# EAGLE design Prog_NRF52 (EAGLE 7.5.0)
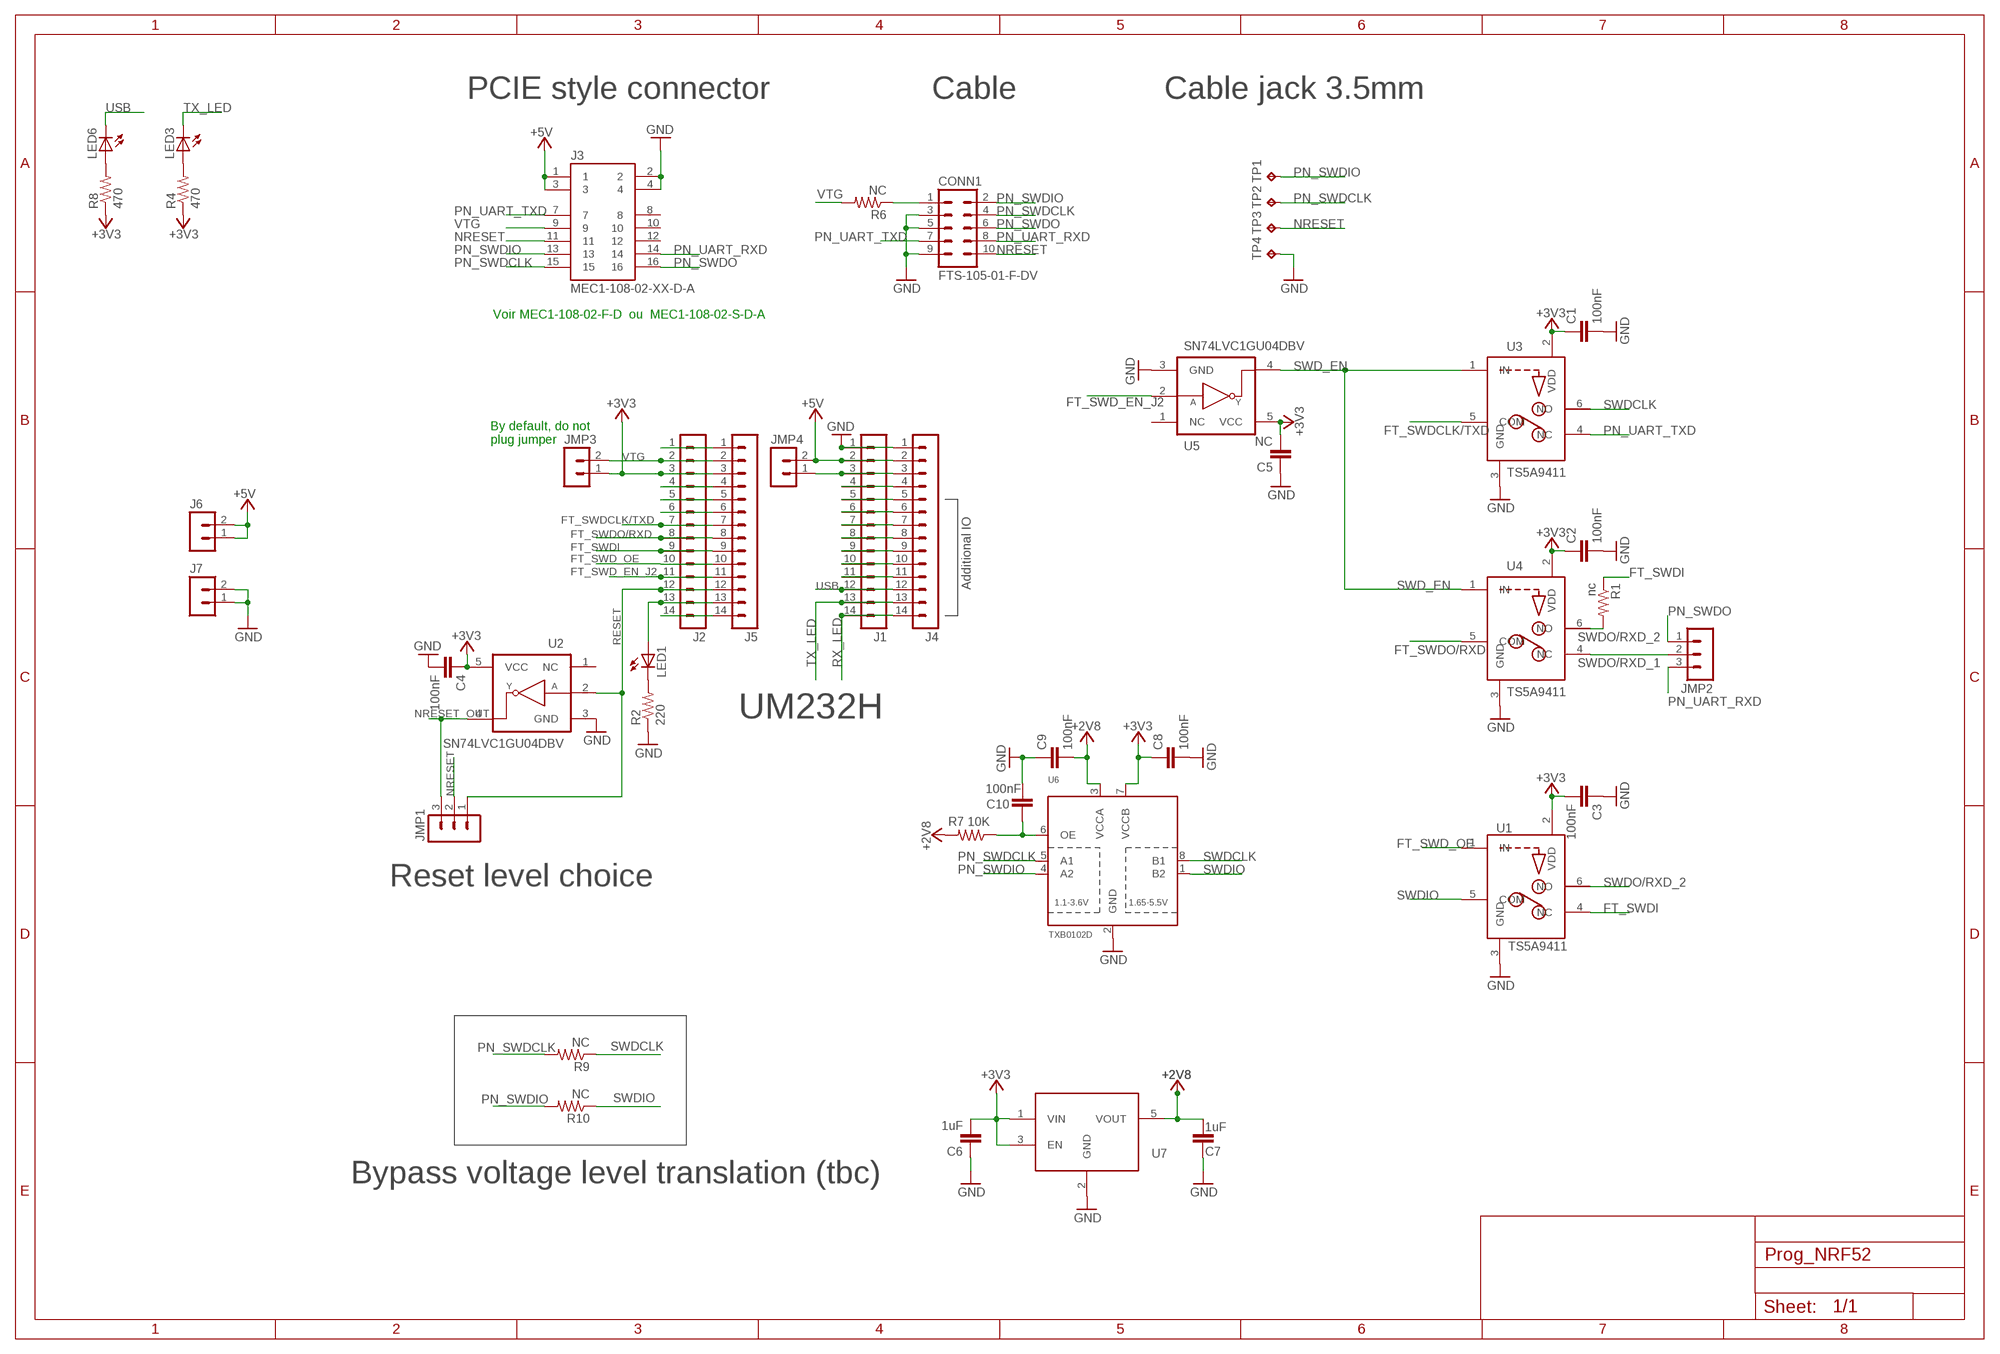
[diagram p0: schematic, sheet 1]

## Parts
C1  100nF  C-EUC0603K  [C0603K]
C2  100nF  C-EUC0603K  [C0603K]
C3  100nF  C-EUC0603K  [C0603K]
C4  100nF  C-EUC0603K  [C0603K]
C5  NC  C-EUC0603K  [C0603K]
C6  1uF  C-EUC0603K  [C0603K]
C7  1uF  C-EUC0603K  [C0603K]
C8  100nF  C-EUC0603K  [C0603K]
C9  100nF  C-EUC0603K  [C0603K]
C10  100nF  C-EUC0603K  [C0603K]
CONN1  FTS-105-01-F-DV  [FTS-105-01-F-DV]
J1  MA14-1  [MA14-1]
J2  MA14-1  [MA14-1]
J3  MEC1-108-02-XX-D-A  [MEC1-108-02-XX-D-A]
J4  MA14-1  [MA14-1]
J5  MA14-1  [MA14-1]
J6  MA02-1  [MA02-1]
J7  MA02-1  [MA02-1]
JMP1  MA03-1  [MA03-1]
JMP2  MA03-1  [MA03-1]
JMP3  MA02-1  [MA02-1]
JMP4  MA02-1  [MA02-1]
LED1  LEDCHIP-LED0603  [CHIP-LED0603]
LED3  LEDCHIP-LED0603  [CHIP-LED0603]
LED6  LEDCHIP-LED0603  [CHIP-LED0603]
R1  nc  R-US_R0603  [R0603]
R2  220  R-US_R0603  [R0603]
R4  470  R-US_R0603  [R0603]
R6  NC  R-US_R0603  [R0603]
R7  10K  R-US_R0603  [R0603]
R8  470  R-US_R0603  [R0603]
R9  NC  R-US_R0603  [R0603]
R10  NC  R-US_R0603  [R0603]
TP1  TPPAD1-13  [P1-13]
TP2  TPPAD1-13  [P1-13]
TP3  TPPAD1-13  [P1-13]
TP4  TPPAD1-13  [P1-13]
U1  TS5A9411  [SC70-6]
U2  SN74LVC1GU04DBV  [SOT23-5]
U3  TS5A9411  [SC70-6]
U4  TS5A9411  [SC70-6]
U5  SN74LVC1GU04DBV  [SOT23-5]
U6  TXB0102D  [VSSOP8]
U7  NCP114ASN280T1G  [SOT23-5]

## Nets
+2V8: C7.2 C9.2 R7.2 U6.3(VCCA) U7.5(VOUT)
+3V3: C1.1 C2.1 C3.2 C4.1 C5.2 C6.2 C8.1 J2.3 J5.3 JMP3.1 R4.1 R8.1 U1.2(VDD) U2.5(VCC) U3.2(VDD) U4.2(VDD) U5.5(VCC) U6.7(VCCB) U7.1(VIN) U7.3(EN)
+5V: J1.2 J3.1 J3.3 J4.2 J6.1 J6.2 JMP4.2
FT_SWD_EN_J2: J2.11 J5.11 U5.2(A)
FT_SWD_OE: J2.10 J5.10 U1.1(IN)
FT_SWDCLK/TXD: J2.7 J5.7 U3.5(COM)
FT_SWDI: J2.9 J5.9 R1.1 U1.4(NC)
FT_SWDO/RXD: J2.8 J5.8 U4.5(COM)
GND: C1.2 C2.2 C3.1 C4.2 C5.1 C6.1 C7.1 C8.2 C9.1 C10.2 CONN1.3 CONN1.5 CONN1.9 J1.1 J3.2 J3.4 J4.1 J7.1 J7.2 R2.1 TP4.TP U1.3(GND) U2.3(GND) U3.3(GND) U4.3(GND) U5.3(GND) U6.2(GND) U7.2(GND)
N$1: J1.3 J4.3 JMP4.1
N$2: LED1.C R2.2
N$3: J2.13 J5.13 LED1.A
N$6: LED3.A R4.2
N$8: J1.4 J4.4
N$9: J1.5 J4.5
N$10: J1.6 J4.6
N$11: J1.7 J4.7
N$12: J1.8 J4.8
N$13: J1.9 J4.9
N$14: J1.10 J4.10
N$15: J1.11 J4.11
N$16: LED6.A R8.2
N$19: J2.1 J5.1
N$20: J2.4 J5.4
N$21: J2.5 J5.5
N$22: J2.6 J5.6
N$24: J2.14 J5.14
N$27: C10.1 R7.1 U6.6(OE)
N$28: CONN1.1 R6.1
NRESET: CONN1.10 J3.11 JMP1.2 TP3.TP
NRESET_OUT: JMP1.3 U2.4(Y)
PN_SWDCLK: CONN1.4 J3.15 R9.2 TP2.TP U6.5(A1)
PN_SWDIO: CONN1.2 J3.13 R10.2 TP1.TP U6.4(A2)
PN_SWDO: CONN1.6 J3.16 JMP2.1
PN_UART_RXD: CONN1.8 J3.14 JMP2.3
PN_UART_TXD: CONN1.7 J3.7 U3.4(NC)
RESET: J2.12 J5.12 JMP1.1 U2.2(A)
RX_LED: J1.14 J4.14
SWD_EN: U3.1(IN) U4.1(IN) U5.4(Y)
SWDCLK: R9.1 U3.6(NO) U6.8(B1)
SWDIO: R10.1 U1.5(COM) U6.1(B2)
SWDO/RXD_1: JMP2.2 U4.4(NC)
SWDO/RXD_2: R1.2 U1.6(NO) U4.6(NO)
TX_LED: J1.13 J4.13 LED3.C
USB: J1.12 J4.12 LED6.C
VTG: J2.2 J3.9 J5.2 JMP3.2 R6.2
Unconnected: J3.8 J3.10 J3.12 U2.1(NC) U5.1(NC)

## Notes on the sheet
- PCIE style connector | Cable | Cable jack 3.5mm
- Voir MEC1-108-02-F-D  ou  MEC1-108-02-S-D-A
- By default, do not 
  plug jumper
- Additional IO
- UM232H
- Reset level choice
- Bypass voltage level translation (tbc)

## Library data of the parts
C1-C10 = rcl:C-EU: CAPACITOR, European symbol
CONN1 = con-Samtec:FTS-105-01-F-DV
J1 J2 J4 J5 = con-lstb:MA14-1: PIN HEADER
J3 = TestBench_MUX:MEC1-108-02-XX-D-A: 1MM MIN-EDGE CARD ASSEMBLY.
J6 J7 JMP3 JMP4 = con-lstb:MA02-1: PIN HEADER
JMP1 JMP2 = con-lstb:MA03-1: PIN HEADER; OC_FARNELL: unknown; OC_NEWARK: unknown
LED1 LED3 LED6 = led:LED: LED OSRAM: - CHIPLED LG R971, LG N971, LY N971, LG Q971, LY Q971, LO R971, LY R971 LH N974, LH R974 LS Q976, LO Q976, LY Q976 LO Q996 - Hyper CHIPLED LW Q18S LB Q993, LB Q99A, LB R99A - SideLED LS A670, LO A670, LY A670, LG A670, LP A670 LB A673, LV A673, LT A673, LW A673 LH A674 LY A675 LS A676, LA A676, LO A676, LY A676, LW A676 LS A679, LY A679, LG A679 - Hyper Micro SIDELED® LS Y876, LA Y876, LO Y876, LY Y876 LT Y87S - SmartLED LW L88C, LW L88S LB L89C, LB L89S, LG L890 LS L89K, LO L89K, LY L89K LS L896, LA L896, LO L896, LY L896 - TOPLED LS T670, LO T670, LY T670, LG T670, LP T670 LSG T670, LSP T670, LSY T670, LOP T670, LYG T670 LG T671, LOG T671, LSG T671 LB T673, LV T673, LT T673, LW T673 LH T674 LS T676, LA T676, LO T676, LY T676, LB T676, LH T676, LSB T676, LW T676 LB T67C, LV T67C, LT T67C, LS T67K, LO T67K, LY T67K, LW E67C LS E67B, LA E67B, LO E67B, LY E67B, LB E67C, LV E67C, LT E67C LW T67C LS T679, LY T679, LG T679 LS T770, LO T770, LY T770, LG T770, LP T770 LB T773, LV T773, LT T773, LW T773 LH T774 LS E675, LA E675, LY E675, LS T675 LS T776, LA T776, LO T776, LY T776, LB T776 LHGB T686 LT T68C, LB T68C - Hyper Mini TOPLED® LB M676 - Mini TOPLED Santana® LG M470 LS M47K, LO M47K, LY M47K Source: http://www.osram.convergy.de LUXEON: - LUMILED® LXK2-PW12-R00, LXK2-PW12-S00, LXK2-PW14-U00, LXK2-PW14-V00 LXK2-PM12-R00, LXK2-PM12-S00, LXK2-PM14-U00 LXK2-PE12-Q00, LXK2-PE12-R00, LXK2-PE12-S00, LXK2-PE14-T00, LXK2-PE14-U00 LXK2-PB12-K00, LXK2-PB12-L00, LXK2-PB12-M00, LXK2-PB14-N00, LXK2-PB14-P00, LXK2-PB14-Q00 LXK2-PR12-L00, LXK2-PR12-M00, LXK2-PR14-Q00, LXK2-PR14-R00 LXK2-PD12-Q00, LXK2-PD12-R00, LXK2-PD12-S00 LXK2-PH12-R00, LXK2-PH12-S00 LXK2-PL12-P00, LXK2-PL12-Q00, LXK2-PL12-R00 Source: www.luxeon.com KINGBRIGHT: KA-3528ASYC Source: www.kingbright.com
R1 R2 R4 R6-R10 = resistor:R-US_: RESISTOR, American symbol
TP1-TP4 = testpad:TP: Test pad
U1 U3 U4 = FabLib:TS5A9411
U2 U5 = 74LV:SN74LVC1GU04: SINGLE INVERTER GATE
U6 = Tmp_PN:TXB0102D: TXB0102 2-Bit Bidirectional Voltage-Level Translator With Auto Direction Sensing and ±15-kV ESD Protection
U7 = Tmp_PN:NCP114ASN280T1G: Low cost fixed regulator 2,8 V, 300mA, SOT-23

## Board
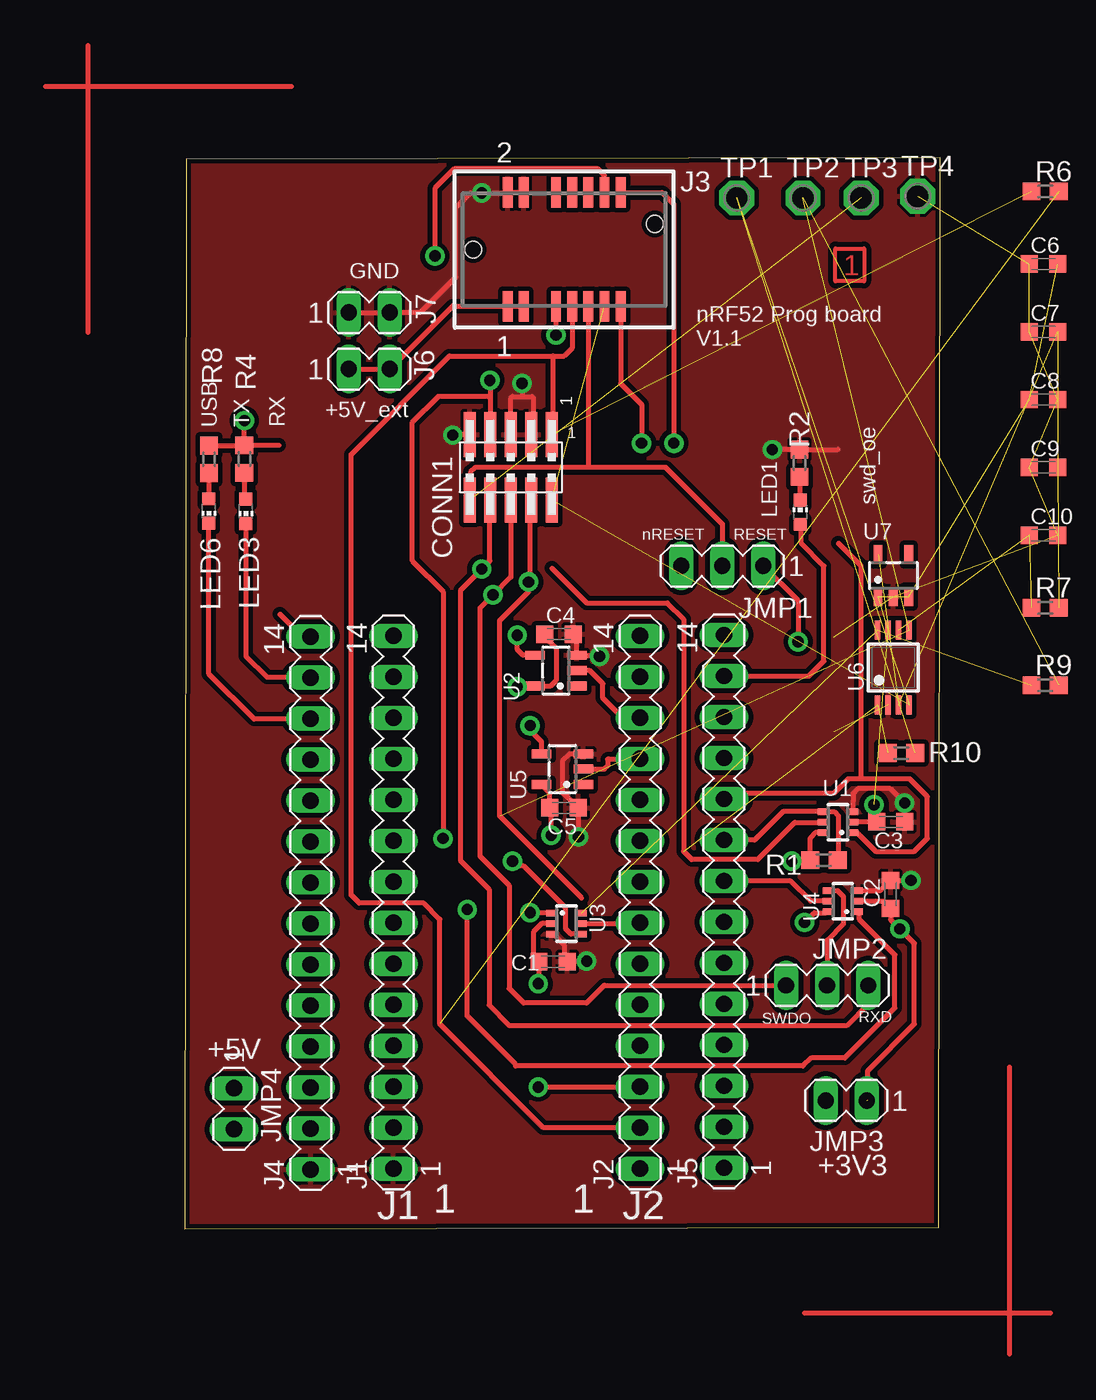
[diagram p1: board, top side]
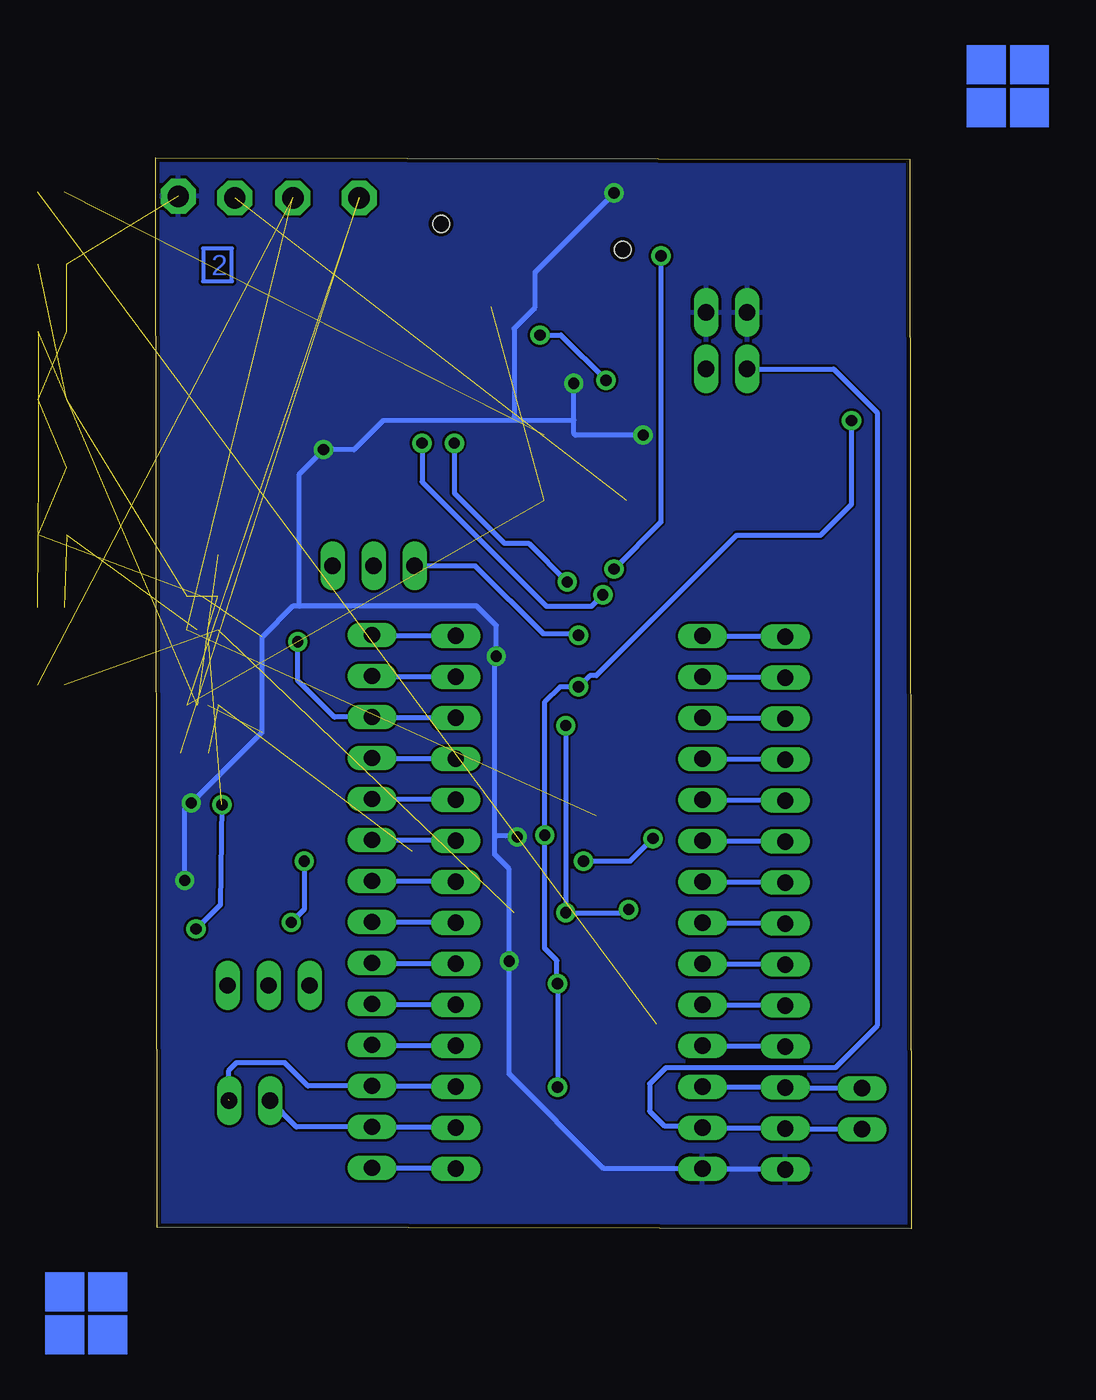
[diagram p2: board, bottom side, seen from below]

Size 46.8 x 66.4 mm. Coordinates in mm from the lower left corner, seen from the top.
Outline: 0,0 46.7,0.1 46.8,66.4 0.1,66.3 0,0
Copper layers (1*16): Top 0.018mm / dielectric 1.55mm / Bottom 0.018mm
Design rules "eC_2Layer_PClass6_BaseCopperO18_eCDefault": minimum track width 0.15mm, minimum drill 0.35mm, track to track 0.15mm, track to pad 0.15mm, pad to pad 0.15mm, via to via 0.15mm, smd to smd 0mil, copper to edge 0.25mm, drill to drill 0.35mm, minimum pad ring 0.175mm, minimum via ring 0.125mm, stop-mask expansion 0mil, vias tented up to drill 0.45mm, thermal gap 0.2mm

### Footprints (pad centres in the part's own frame; a part is rotated, then mirrored left to right if it is on the bottom)
C0603K = smd 1.05 x 1.08: 1 -0.875,0; 2 0.875,0
FTS-105-01-F-DV = smd 2.794 x 0.737: 1 -2.032,2.54; 2 2.032,2.54; 3 -2.032,1.27; 4 2.032,1.27; 5 -2.032,0; 6 2.032,0; 7 -2.032,-1.27; 8 2.032,-1.27; 9 -2.032,-2.54; 10 2.032,-2.54
MA14-1 = drill 1.016 long: 1 -16.51,0; 2 -13.97,0; 3 -11.43,0; 4 -8.89,0; 5 -6.35,0; 6 -3.81,0; 7 -1.27,0; 8 1.27,0; 9 3.81,0; 10 6.35,0; 11 8.89,0; 12 11.43,0; 13 13.97,0; 14 16.51,0
MEC1-108-02-XX-D-A = smd 0.61 x 1.88: 1 -3.5,-3.53; 2 -3.5,3.53; 3 -2.5,-3.53; 4 -2.5,3.53; 7 -0.5,-3.53; 8 -0.5,3.53; 9 0.5,-3.53; 10 0.5,3.53; 11 1.5,-3.53; 12 1.5,3.53; 13 2.5,-3.53; 14 2.5,3.53; 15 3.5,-3.53; 16 3.5,3.53 | hole 1.02: -5.622,0; 5.622,1.588
MA02-1 = drill 1.016 long: 1 -2.54,0; 2 0,0
MA03-1 = drill 1.016 long: 1 -2.54,0; 2 0,0; 3 2.54,0
CHIP-LED0603 = smd 0.8 x 0.8: A 0,-0.75; C 0,0.75
R0603 = smd 1.1 x 1.1: 1 -0.85,0; 2 0.85,0
P1-13 = drill 1.321 pad 2.159 octagon: TP 0,0
SC70-6 = smd 0.4 x 0.6: 1 -0.65,-0.95; 2 0,-0.95; 3 0.65,-0.95; 4 0.65,0.95; 5 0,0.95; 6 -0.65,0.95
SOT23-5 = smd 0.55 x 1.2: 1 -0.95,-1.3; 2 0,-1.3; 3 0.95,-1.3; 4 0.95,1.3; 5 -0.95,1.3
VSSOP8 = smd 0.35 x 1.2: 1 -0.975,-2.325; 2 -0.325,-2.325; 3 0.325,-2.325; 4 0.975,-2.325; 5 0.975,2.325; 6 0.325,2.325; 7 -0.325,2.325; 8 -0.975,2.325

### Placement (x,y rotation side)
C1  22.82,16.57 0 top
C2  43.73,20.74 90 top
C3  43.74,25.23 180 top
C4  23.18,36.87 0 top
C5  23.5,26.1 180 top
C6  53.2,59.8 0 top  (outside the outline)
C7  53.2,55.6 0 top  (outside the outline)
C8  53.2,51.4 0 top  (outside the outline)
C9  53.2,47.2 0 top  (outside the outline)
C10  53.2,43 0 top  (outside the outline)
CONN1  20.2,47.2 270 top
J1  12.93,20.25 90 top
J2  28.21,20.25 90 top
J3  23.5,60.7 0 top
J4  7.8,20.2 90 top
J5  33.4,20.3 90 top
J6  12.7,53.3 0 top
J7  12.7,56.8 0 top
JMP1  33.3,41.1 180 top
JMP2  39.8,15.1 0 top
JMP3  39.71,7.96 180 top
JMP4  3.04,6.19 270 top
LED1  38.13,44.42 0 top
LED3  3.79,44.48 180 top
LED6  1.5,44.5 180 top
R1  39.6,22.86 180 top
R2  38.09,47.46 270 top
R4  3.69,47.72 270 top
R6  53.3,64.3 0 top  (outside the outline)
R7  53.3,38.5 0 top  (outside the outline)
R8  1.5,47.7 270 top
R9  53.3,33.7 0 top  (outside the outline)
R10  44.4,29.5 0 top
TP1  34.2,63.9 0 top
TP2  38.3,63.9 0 top
TP3  41.9,63.9 0 top
TP4  45.4,64 0 top
U1  40.46,25.22 90 top
U2  22.99,34.61 90 top
U3  23.64,18.93 270 top
U4  40.76,20.32 90 top
U5  23.4,28.5 90 top
U6  43.9,34.8 0 top
U7  43.9,40.5 0 top

### Tracks (layer width: path | path; a pad name or v marks a point on that pad's centre or on a via)
+2V8  (4 unrouted)
+3V3  (via drill 0.7 pad 1.2)  (6 unrouted)
  Top 0.3: C3.2 42.75,25.23 | 42.75,25.23 U1.2 | U4.2 43.28,20.32 C2.1 | U3.2 22.13,18.93 21.6,18.4 21.6,16.92 C1.1 21.95,15.24 v21.9,15.2 | U5.5 22.62,27.03 C5.2 22.7,26.03 v22.7,24.4 22.7,24.3 | v21.9,8.8 28.19,8.8 J2.3 | v20.6,33.6 21.63,33.6 U2.5 22.66,33.66 23,34 23,36 22.3,36.7 C4.1 | 43.77,19.9 C2.1 | 42.75,25.23 42.75,26.05 v42.7,26.3 | C2.1 43.73,19.17 v44.3,18.6 45.2,17.7 45.2,12.7 42.3,9.8 v42.3,8.01 | R8.1 3.67,48.55 R4.1 | R4.1 5.83,48.57 | R4.1 v3.69,50.09 v3.7,50.1
  Bottom 0.3: v21.9,8.8 v21.9,15.2 21.95,15.24 21.95,16.65 22.7,17.4 v22.7,24.4 22.7,32.65 21.75,33.6 v20.6,33.6 19.9,34.3 19.5,34.3 10.8,43 5.6,43 3.7,44.9 v3.7,50.1 | J2.3 28.26,8.87 J5.3 37.37,8.87 38.8,10.3 41.8,10.3 42.3,9.8 v42.3,8.01 | v42.7,26.3 42.8,20.1 v44.3,18.6
+5V
  Top 0.3: J3.3 J3.1 19.97,57.2 16.6,57.2 J6.2 J6.1
  Bottom 0.3: JMP4.2 7.76,6.19 J4.2 7.85,6.28 J1.2 13.05,6.4 15.3,6.4 16.2,7.3 16.2,9 15.2,10 4.7,10 2.1,12.6 2.1,50.6 4.8,53.3 J6.1
FT_SWD_EN_J2
  Top 0.3: U5.2 26,28.5 26.2,28.7 26.2,29.1 26.24,29.14 J2.11
  Bottom 0.3: J2.11 33.35,29.14 J5.11
FT_SWD_OE
  Top 0.3: 41.9,27.9 44.9,27.9 46,26.8 46,24.2 45.2,23.4 42.8,23.4 41.63,24.57 U1.1 | 41.9,27.9 41.1,27.9 40.2,27 33.75,27 J5.10 | 41.9,27.9 41.9,41.1 40.5,42.5
  Bottom 0.3: J5.10 28.26,26.65 J2.10
FT_SWDCLK/TXD
  Top 0.3: U3.5 28.21,18.93 J2.7
  Bottom 0.3: J5.7 28.26,19.03 J2.7
FT_SWDI
  Top 0.3: R1.1 40.45,22.91 40.5,22.91 40.5,25.6 40.23,25.87 U1.4 37.07,25.87 35.3,24.1 J5.9
  Bottom 0.3: J5.9 28.26,24.11 J2.9
FT_SWDO/RXD
  Top 0.3: U4.5 38.77,20.32 37.52,21.57 J5.8
  Bottom 0.3: J5.8 28.26,21.57 J2.8
GND  (via drill 0.7 pad 1.2)  (8 unrouted)
  Top 0.3: CONN1.5 20.2,51.5 20.3,51.6 20.9,51.6 | 20.9,51.6 21.5,51.6 21.6,51.5 21.6,49.36 CONN1.3 | U4.3 43.09,20.97 C2.2 | U3.3 22.82,18.28 23.5,17.6 23.5,16.77 C1.2 23.72,16.6 v24.9,16.6 | U5.3 23.85,29.45 23.4,29 23.4,27.08 C5.1 24.4,26.08 v24.4,24.3 | C4.2 24.29,36.63 U2.3 24.35,35.5 v25.7,35.5 | C2.2 43.73,21.97 43.7,22 | v20.9,52.4 20.9,51.6 | C3.1 44.62,26.39 v44.6,26.4 | C2.2 44.98,21.62 v45,21.6 | U1.3 41.41,26.51 | 44.5,26.5 v44.6,26.4 | v44.6,26.4 43.7,27.3 41.7,27.3 41.4,27 41.4,26.5 41.41,26.51 | 41.41,26.81 41.41,26.51 | CONN1.9 16.43,49.23 v16.6,49.2 | 40.46,48.31 R2.1 v36.41,48.31 v36.4,48.3 | J3.4 J3.2 19.97,64.2 v18.4,64.2 17.7,64.2 16.8,63.3 16.8,59 14.6,56.8 J7.2 J7.1
  Bottom 0.3: J4.1 7.85,3.74 J1.1 19.04,3.74 24.9,9.6 v24.9,16.6 24.9,22.3 25.8,23.2 25.8,24.4 | 20.9,50.1 20.9,49.3 20.8,49.2 v16.6,49.2 | 20.9,50.1 v20.9,52.4 | 37.9,38.6 26.9,38.6 25.7,37.4 v25.7,35.5 25.8,35.4 25.8,24.4 | 37.9,38.6 38.3,38.6 40.2,36.7 40.2,30.8 v44.6,26.4 45,26 v45,21.6 | 20.9,50.1 24.4,50.1 | 24.4,50.1 32.7,50.1 34.5,48.3 v36.4,48.3 37.9,46.8 37.9,38.6 | v18.4,64.2 23.3,59.3 23.3,57.1 24.6,55.8 24.6,50.3 24.4,50.1 | 25.8,24.4 24.5,24.4 v24.4,24.3
  pour Top (isolate 0.3): -0.8,56.3 -1,56.3 -1,-1.9 48.6,-1.9 48.1,66.5 -1.3,66.5
  pour Bottom: -1.3,66.4 -1.3,-2 48.6,-2 48.6,66.5 -1.2,66.5
N$1
  Bottom 0.3: JMP4.1 7.76,8.73 J4.3 7.85,8.82 J1.3
N$2
  Top 0.3: R2.2 38.09,45.21 LED1.C
N$3
  Top 0.3: LED1.A 38.2,43.6 38.2,42.5 39.6,41.1 39.6,35.2 38.67,34.27 J5.13
  Bottom 0.3: J2.13 33.35,34.22 J5.13
N$5
  Top 0.254: 40.31,60.77 42.09,60.77 42.09,58.73 40.31,58.73 40.31,60.77
N$6
  Top 0.3: R4.2 3.7,45.32 LED3.A
N$8
  Bottom 0.3: J4.4 12.88,11.31 J1.4
N$9
  Bottom 0.3: J4.5 12.88,13.85 J1.5
N$10
  Bottom 0.3: J4.6 12.88,16.39 J1.6
N$11
  Bottom 0.3: J4.7 12.88,18.93 J1.7
N$12
  Bottom 0.3: J4.8 12.88,21.47 J1.8
N$13
  Bottom 0.3: J1.9 7.85,24.06 J4.9
N$14
  Bottom 0.3: J4.10 12.88,26.55 J1.10
N$15
  Bottom 0.3: J4.11 12.88,29.09 J1.11
N$16
  Top 0.3: R8.2 LED6.A
N$17
  Bottom 0.254: 42.09,60.77 43.86,60.77 43.86,58.73 42.09,58.73 42.09,60.77
N$18
  Top 0.305: -6,73.36 -6,55.58
N$19
  Bottom 0.3: J5.1 28.26,3.79 J2.1
N$20
  Bottom 0.3: J2.4 33.35,11.36 J5.4
N$21
  Bottom 0.3: J2.5 33.35,13.9 J5.5
N$22
  Bottom 0.3: J2.6 33.35,16.44 J5.6
N$23
  Top 0.305: -8.64,70.82 6.6,70.82
N$24
  Bottom 0.3: J2.14 33.35,36.76 J5.14
N$25
  Top 0.305: 51.1,-7.76 51.1,10.02
N$26
  Top 0.305: 53.64,-5.22 38.4,-5.22
N$27  (2 unrouted)
N$28  (1 unrouted)
NRESET  (1 unrouted)
  Top 0.3: 25,47.2 29.8,47.2 33.3,43.7 JMP1.2 | 25,47.2 18,47.2 17.7,46.9 17.7,45.21 CONN1.10 | J3.11 25,47.2
NRESET_OUT  (via drill 0.7 pad 1.2)
  Top 0.3: U2.4 20.94,35.56 20.6,35.9 v20.6,36.8
  Bottom 0.3: JMP1.3 27,41.1 22.8,36.9 20.7,36.9 v20.6,36.8
PN_SWDCLK  (via drill 0.7 pad 1.2)  (3 unrouted)
  Top 0.3: 24.59,20.51 19.5,25.6 19.5,37.7 21.3,39.5 v21.3,40.1 21.4,40.2 | 21.4,40.1 21.4,40.2 | 21.4,40.2 21.4,45.1 CONN1.4 | J3.15 27,52.4 28.3,51.1 v28.3,48.7
  Bottom 0.3: v21.3,40.1 23.7,42.5 25.2,42.5 28.3,45.6 v28.3,48.7
PN_SWDIO  (4 unrouted)
PN_SWDO  (via drill 0.7 pad 1.2)
  Top 0.3: CONN1.6 20.2,40.4 v19.1,39.3 18.3,38.5 18.3,23.1 20.1,21.3 20.1,14.9 21,14 24.9,14 26,15.1 JMP2.1 | J3.16 29.57,64.23 30.3,63.5 v30.3,48.7
  Bottom 0.3: v30.3,48.7 30.3,46.3 22.6,38.6 19.8,38.6 v19.1,39.3
PN_UART_RXD  (via drill 0.7 pad 1.2)
  Top 0.3: CONN1.8 18.9,45.14 18.9,41.4 v18.4,40.9 18.05,40.55 17.1,39.6 17.1,22.8 18.85,21.05 18.85,13.88 20.13,12.6 41,12.6 42.34,13.94 JMP2.3 | J3.14 26,65.3 25.6,65.7 16.7,65.7 15.5,64.5 v15.5,60.3
  Bottom 0.3: v15.5,60.3 15.5,43.8 v18.4,40.9
PN_UART_TXD  (via drill 0.7 pad 1.2)
  Top 0.3: U3.4 23.92,18.28 23.6,18.6 23.6,19.9 21,22.5 20.6,22.5 v20.3,22.8 | v16,24.2 16,39.5 14.1,41.4 14.1,50 15.7,51.6 18.83,51.6 18.93,51.5 | 18.93,51.5 18.93,52.57 v18.9,52.6 | 18.93,51.5 CONN1.7 | v23,55.4 J3.7
  Bottom 0.3: 16.1,24.1 v16,24.2 17.4,22.8 v20.3,22.8 | v23,55.4 21.7,55.4 v18.9,52.6
RESET  (via drill 0.7 pad 1.2)
  Top 0.3: J2.12 27.12,31.68 25.9,32.9 25.9,33.8 25.1,34.6 U2.2 | v38,36.4 38,38.94 JMP1.1
  Bottom 0.3: J2.12 33.35,31.68 J5.12 35.73,31.73 38,34 v38,36.4
RX_LED
  Top 0.3: J4.14 7.71,36.8 7.2,36.8 5.9,38.1
  Bottom 0.3: J1.14 7.85,36.76 J4.14
SWD_EN  (via drill 0.7 pad 1.2)
  Top 0.3: v17.5,19.8 17.5,13.2 20.5,10.2 20.5,10.1 38.3,10.1 38.8,10.6 40.9,10.6 44,13.7 44,17 41.8,19.2 41.8,19.58 U4.1 | U3.1 21.42,19.58 v21.4,19.6 | U5.4 22.1,30.2 21.4,30.9 v21.4,31.2 | U5.4
  Bottom 0.3: v17.5,19.8 17.7,19.6 v21.4,19.6 v21.4,31.2
SWDCLK  (2 unrouted)
SWDIO  (2 unrouted)
  Top 0.3: 22.74,40.96 24.9,38.8 29.9,38.8 30.9,37.8 30.9,23.4 31.4,22.9 35.5,22.9 37.8,25.2 39.49,25.2 U1.5
SWDO/RXD_1
  Top 0.3: U4.4 40.43,20.97 40.8,20.6 40.8,18.9 39.8,17.9 JMP2.2
SWDO/RXD_2  (via drill 0.7 pad 1.2)
  Top 0.3: U1.6 39.07,24.57 38.75,24.25 R1.2 37.66,22.86 v37.6,22.8 | v38.4,19 39,19.6 39.74,19.6 U4.6
  Bottom 0.3: v37.6,22.8 37.6,19.8 v38.4,19
TX_LED
  Top 0.3: 7.78,34.19 J4.13 7.77,34.2 5.1,34.2 3.79,35.51 LED3.C
  Bottom 0.3: J4.13 12.88,34.17 J1.13
USB
  Top 0.3: J4.12 7.77,31.6 4.3,31.6 1.5,34.4 LED6.C
  Bottom 0.3: J4.12 12.88,31.63 J1.12
VTG  (1 unrouted)
  Top 0.3: J2.2 22.22,6.28 15.8,12.7 15.8,19.2 14.8,20.2 10.8,20.2 10.3,20.7 10.3,48 16.4,54.1 22.8,54.1 | 22.8,54.1 23.5,54.1 24,54.6 J3.9 | 22.8,54.1 22.8,49.29
  Bottom 0.3: J2.2 28.26,6.33 J5.2 38.08,6.33 JMP3.2
(copper drawn outside any net)
  shapes: Bottom area x8

### Text on the board
Top: 1
Bottom: 2
tNames: GND | nRF52 Prog board / V1.1 | USB | TX | RX | +5V_ext | 1 | swd_oe | nRESET | RESET | SWDO | RXD | +5V | +3V3 | 1 | 1 | J1 | J2